# Altium schematic sheet [12]-Valve-Control.SchDoc: Valve-Control
size A3; Organization: Toradex AG; Address1: Altsagenstrasse 5; Address2: Horw; Address3: 6048; Address4: Switzerland; DocumentNumber: 11; Revision: V3.2; SheetNumber: 11; SheetTotal: 13; PageSetup: Record=PageOptions|CenterHorizontal=True|CenterVertical=True|PrintScale=0.73|XCorrection=1.00|YCorrection=1.00|PrintKind=0|BorderSize=5000000|LeftOffset=0|BottomOffset=0|Orientation=2|PaperLength=1000|PaperWidth=1000|Scale=100|PaperSource=7|PrintQuality=-4|MediaType=1|DitherType=10|PaperKind=A4|PrintScaleMode=1
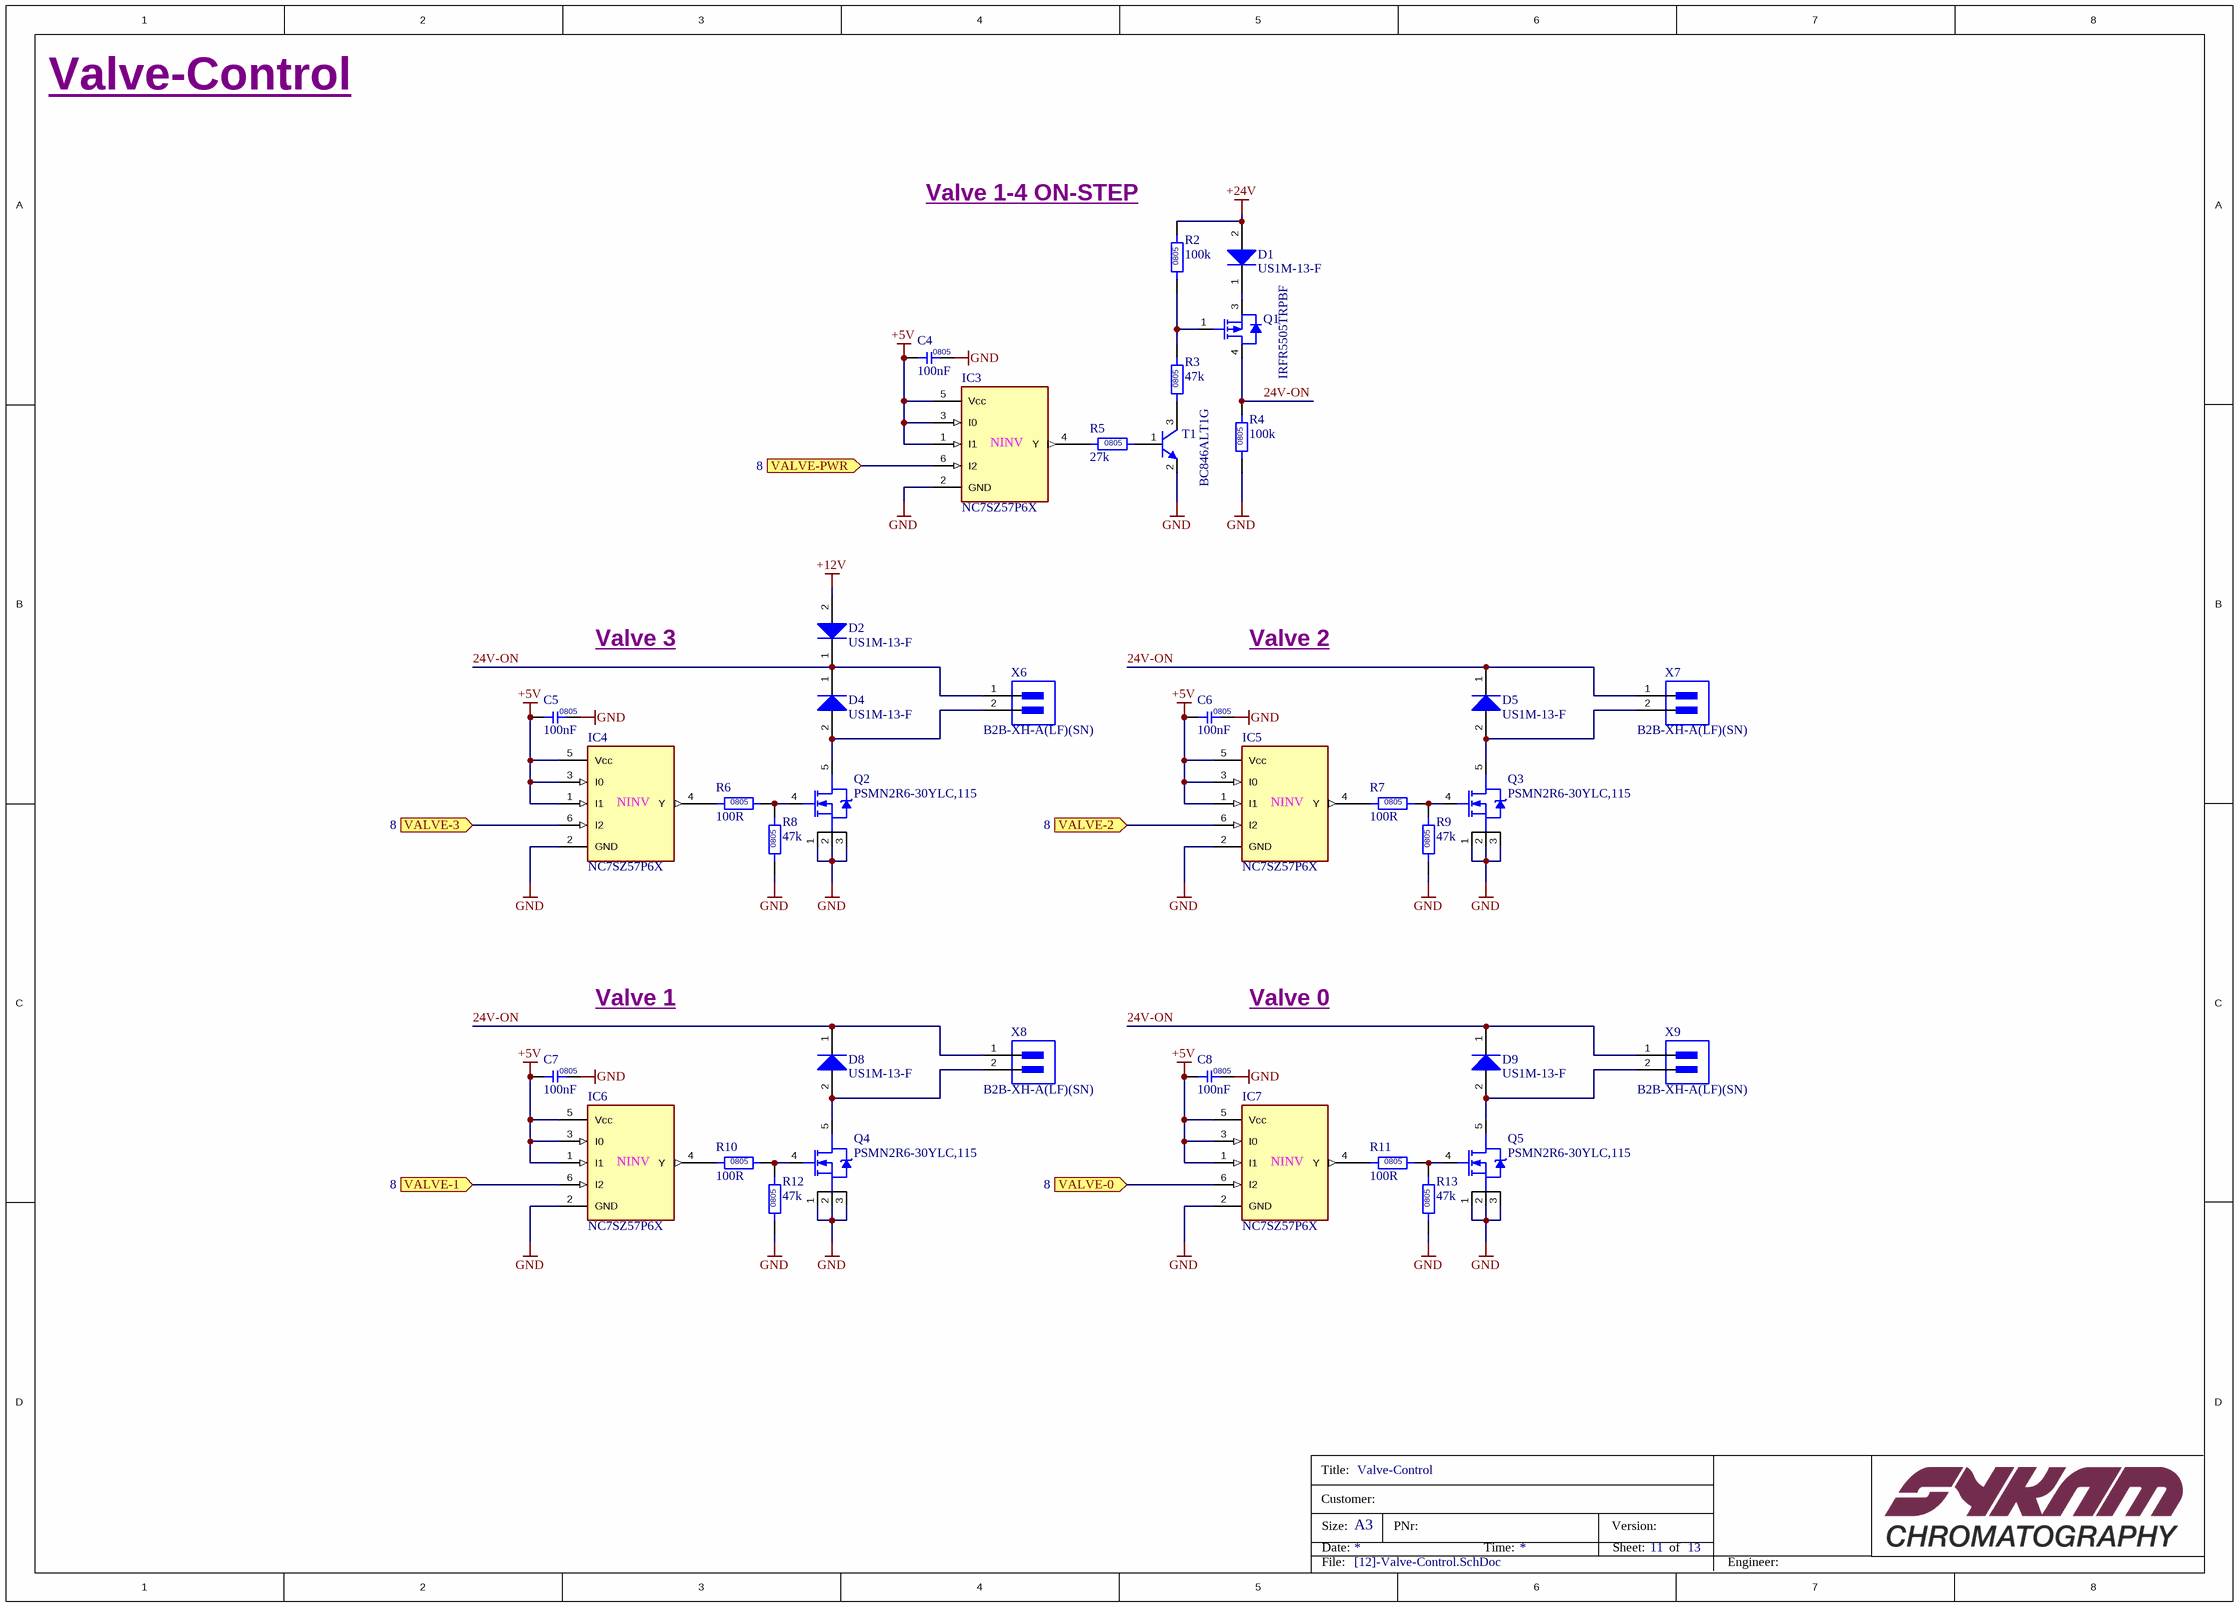
[diagram p0: [12]-Valve-Control.SchDoc]

## Parts
C4  100nF  [C0805]
C5  100nF  [C0805]
C6  100nF  [C0805]
C7  100nF  [C0805]
C8  100nF  [C0805]
D1  US1M-13-F  [US1M-SMA-2_A_V]
D2  US1M-13-F  [US1M-SMA-2_A_V]
D4  US1M-13-F  [US1M-SMA-2_A_V]
D5  US1M-13-F  [US1M-SMA-2_A_V]
D8  US1M-13-F  [US1M-SMA-2_A_V]
D9  US1M-13-F  [US1M-SMA-2_A_V]
IC3  NC7SZ57P6X  [NC7SZ57P6X]
IC4  NC7SZ57P6X  [NC7SZ57P6X]
IC5  NC7SZ57P6X  [NC7SZ57P6X]
IC6  NC7SZ57P6X  [NC7SZ57P6X]
IC7  NC7SZ57P6X  [NC7SZ57P6X]
Q1  IRFR5505TRPBF  [PMOS-DPak]
Q2  PSMN2R6-30YLC,115  [PSMN2R6-LFPAK_SOT669]
Q3  PSMN2R6-30YLC,115  [PSMN2R6-LFPAK_SOT669]
Q4  PSMN2R6-30YLC,115  [PSMN2R6-LFPAK_SOT669]
Q5  PSMN2R6-30YLC,115  [PSMN2R6-LFPAK_SOT669]
R2  100k  [R0805]
R3  47k  [R0805]
R4  100k  [R0805]
R5  27k  [R0805]
R6  100R  [R0805]
R7  100R  [R0805]
R8  47k  [R0805]
R9  47k  [R0805]
R10  100R  [R0805]
R11  100R  [R0805]
R12  47k  [R0805]
R13  47k  [R0805]
T1  BC846ALT1G  [ONSC-SOT-23-3-318-08_V]
X6  B2B-XH-A(LF)(SN)  [CON_2p_JST-B2B-XH-A_V]
X7  B2B-XH-A(LF)(SN)  [CON_2p_JST-B2B-XH-A_V]
X8  B2B-XH-A(LF)(SN)  [CON_2p_JST-B2B-XH-A_V]
X9  B2B-XH-A(LF)(SN)  [CON_2p_JST-B2B-XH-A_V]

## Ports
VALVE-0 (in, see 8), VALVE-1 (in, see 8), VALVE-2 (in, see 8), VALVE-3 (in, see 8), VALVE-PWR (in, see 8)

## Nets
+5V: C4.1 C5.1 C6.1 C7.1 C8.1 IC3.1(I1) IC3.3(I0) IC3.5(Vcc) IC4.1(I1) IC4.3(I0) IC4.5(Vcc) IC5.1(I1) IC5.3(I0) IC5.5(Vcc) IC6.1(I1) IC6.3(I0) IC6.5(Vcc) IC7.1(I1) IC7.3(I0) IC7.5(Vcc)
+12V: D2.2(K)
+24V: D1.2(K) R2.2
GND: C4.2 C5.2 C6.2 C7.2 C8.2 IC3.2(GND) IC4.2(GND) IC5.2(GND) IC6.2(GND) IC7.2(GND) Q2.1(D) Q2.2(D) Q2.3(D) Q3.1(D) Q3.2(D) Q3.3(D) Q4.1(D) Q4.2(D) Q4.3(D) Q5.1(D) Q5.2(D) Q5.3(D) R4.1 R8.1 R9.1 R12.1 R13.1 T1.2(E)
24V-ON: D2.1(A) D4.1(A) D5.1(A) D8.1(A) D9.1(A) Q1.4(D) R4.2 X6.1 X7.1 X8.1 X9.1
VALVE-0: IC7.6(I2) ; port VALVE-0
VALVE-1: IC6.6(I2) ; port VALVE-1
VALVE-2: IC5.6(I2) ; port VALVE-2
VALVE-3: IC4.6(I2) ; port VALVE-3
VALVE-PWR: IC3.6(I2) ; port VALVE-PWR
NetD1_1: D1.1(A) Q1.3(S)
NetD4_2: D4.2(K) Q2.5(D) X6.2
NetD5_2: D5.2(K) Q3.5(D) X7.2
NetD8_2: D8.2(K) Q4.5(D) X8.2
NetD9_2: D9.2(K) Q5.5(D) X9.2
NetIC3_4: IC3.4(Y) R5.1
NetIC4_4: IC4.4(Y) R6.1
NetIC5_4: IC5.4(Y) R7.1
NetIC6_4: IC6.4(Y) R10.1
NetIC7_4: IC7.4(Y) R11.1
NetQ1_1: Q1.1(G) R2.1 R3.2
NetQ2_4: Q2.4(G) R6.2 R8.2
NetQ3_4: Q3.4(G) R7.2 R9.2
NetQ4_4: Q4.4(G) R10.2 R12.2
NetQ5_4: Q5.4(G) R11.2 R13.2
NetR3_1: R3.1 T1.3(C)
NetR5_2: R5.2 T1.1(B)

## Notes on the sheet
- Valve 1-4 ON-STEP
- (near IC3) NINV
- Valve 3
- Valve 2
- (near IC4) NINV
- (near IC5) NINV
- Valve 1
- Valve 0
- (near IC6) NINV
- (near IC7) NINV
- Title:
- Customer:
- Size:
- Date:
- A3
- PNr:
- Time:
- Version:
- Sheet:
- of
- File:
- Engineer:
- Title
- Number:
- Revision:
- Sheet

## Library data of the parts
C4-C8 = C_100nF_CC0805KRX7R9BB104: CAP CER 0.1UF 50V X7R 0805; Manufacturer: Yageo; Material: Ceramic; Tolerance: 10%; Insulation Resistance: 100GR; PCBChecked: initials after Checked; Supplier 1: Digi-Key; Manufacturer Part Number: CC0805KRX7R9BB104; RoHS: Yes; Category: Ceramic Capacitors; Mount: Surface Mount; Case/Package: 0805; Number of Pins: 2; Case Code (Metric): 2012; Case Code (Imperial): 0805; Min Operating Temperature: -55°C; Max Operating Temperature: 125°C; Packaging: Tape and Reel; Capacitance: 100nF; Voltage Rating: 50V; Package Quantity: 1; Dielectric: X7R; Termination: SMD/SMT; Voltage: 50V; Length: 2mm; Height: 0.85mm; Width: 0.049inch; Thickness: 0.033inch; Depth: 1.25mm; Radiation Hardening: No; REACH SVHC: No SVHC; Lead Free: Lead Free; Halogen Free: Halogen Free; ComponentLink1URL: https://datasheet.ciiva.com/11786/0900766b80d84f1d-11786009.pdf?src-supplier=RSComponents; ComponentLink1Description: https://datasheet.ciiva.com/11786/0900766b80d84f1d-11786009.pdf?src-supplier=RSComponents; ComponentLink2URL: https://datasheet.ciiva.com/11464/upy-gphc-x7r-6-3v-to-50v-8-11464757.pdf?src-supplier=Avnet; ComponentLink2Description: https://datasheet.ciiva.com/11464/upy-gphc-x7r-6-3v-to-50v-8-11464757.pdf?src-supplier=Avnet; ComponentLink3URL: https://datasheet.ciiva.com/28450/1489800-28450805.pdf?src-supplier=Element14; ComponentLink3Description: https://datasheet.ciiva.com/28450/1489800-28450805.pdf?src-supplier=Element14; ComponentLink4URL: https://datasheet.ciiva.com/155/mlccorderingcode-155929.pdf?src-supplier=Digi-Key; ComponentLink4Description: https://datasheet.ciiva.com/155/mlccorderingcode-155929.pdf?src-supplier=Digi-Key; ComponentLink5URL: https://datasheet.ciiva.com/155/mlccorderingcode-155930.pdf?src-supplier=Digi-Key; ComponentLink5Description: https://datasheet.ciiva.com/155/mlccorderingcode-155930.pdf?src-supplier=Digi-Key; ComponentLink6URL: https://datasheet.ciiva.com/155/mlccorderingcode-155931.pdf?src-supplier=Digi-Key; ComponentLink6Description: https://datasheet.ciiva.com/155/mlccorderingcode-155931.pdf?src-supplier=Digi-Key; ComponentLink7URL: https://datasheet.ciiva.com/46393/1734573-46393307.pdf?src-supplier=Element14; ComponentLink7Description: https://datasheet.ciiva.com/46393/1734573-46393307.pdf?src-supplier=Element14; ComponentLink8URL: https://datasheet.ciiva.com/16625/upy-gphc-x7r-6-3v-to-50v-8-16625549.pdf?src-supplier=Avnet+Europe; ComponentLink8Description: https://datasheet.ciiva.com/16625/upy-gphc-x7r-6-3v-to-50v-8-16625549.pdf?src-supplier=Avnet+Europe; ComponentLink9URL: https://datasheet.ciiva.com/29242/445210-da-01-en-kerko-chip-0805-x7r-0-1uf-10proz-50vg-29242074.pdf?src-supplier=Conrad; ComponentLink9Description: https://datasheet.ciiva.com/29242/445210-da-01-en-kerko-chip-0805-x7r-0-1uf-10proz-50vg-29242074.pdf?src-supplier=Conrad; Supplier Part Number 1: 311-1140-6-ND; Stock 1: 7118979; IPC7352C: done; SCHChecked: Initials after checked
D1 D2 D4 D5 D8 D9 = D_US1M-13-F: Diode Switching 1KV 1A 2-Pin SMA T/R; Manufacturer: Diodes; Element Configuration: Single; Forward Voltage: 1.7V; Reverse Recovery Time: 75ns; Peak Non-Repetitive Surge Current: 30A; Max Reverse Current: 5uA; Polarity: Standard; Capacitance: 10pF; Supplier 1: Farnell; Manufacturer Part Number: US1M-13-F; RoHS: Yes; Category: Rectifier Diodes; Stock 1: 15876; Pricing 1: 5=0,29300, 25=0,21800, 100=0,14200, 250=0,12400, 500=0,10500, 1000=0,08140, 5000=0,07050 (EUR); Mount: Surface Mount; Case/Package: SMA; Number of Pins: 2; Weight: 0.002258oz; Contact Plating: Tin,Matte; Min Operating Temperature: -65°C; Max Operating Temperature: 150°C; Packaging: Tape and Reel; Average Rectified Current: 1A; Max Reverse Voltage (DC): 1kV; Max Repetitive Reverse Voltage (Vrrm): 1kV; Package Quantity: 5000; Forward Current: 1A; Recovery Time: 75ns; Max Surge Current: 30A; Max Forward Surge Current (Ifsm): 30A; Voltage Rating (DC): 1kV; Current Rating: 1A; Output Current: 1A; Termination: SMD/SMT; Reverse Voltage (DC): 1kV; Length: 4.6mm; Width: 2.92mm; Height: 2.1mm; Radiation Hardening: No; Lead Free: Lead Free; REACH SVHC: No SVHC; ComponentLink1URL: https://datasheet.ciiva.com/27052/1542696-27052440.pdf?src-supplier=Jameco; ComponentLink1Description: https://datasheet.ciiva.com/27052/1542696-27052440.pdf?src-supplier=Jameco; ComponentLink2URL: https://datasheet.ciiva.com/4454/ds16008-60440-4454096.pdf?src-supplier=Mouser; ComponentLink2Description: https://datasheet.ciiva.com/4454/ds16008-60440-4454096.pdf?src-supplier=Mouser; ComponentLink3URL: https://datasheet.ciiva.com/917/ds16008-917195.pdf?src-supplier=Digi-Key; ComponentLink3Description: https://datasheet.ciiva.com/917/ds16008-917195.pdf?src-supplier=Digi-Key; ComponentLink4URL: https://datasheet.ciiva.com/917/ds16008-917196.pdf?src-supplier=Digi-Key; ComponentLink4Description: https://datasheet.ciiva.com/917/ds16008-917196.pdf?src-supplier=Digi-Key; ComponentLink5URL: https://datasheet.ciiva.com/22695/1906610-22695853.pdf?src-supplier=Element14; ComponentLink5Description: https://datasheet.ciiva.com/22695/1906610-22695853.pdf?src-supplier=Element14; ComponentLink6URL: https://datasheet.ciiva.com/8301/ds16008-8301519.pdf?src-supplier=Avnet; ComponentLink6Description: https://datasheet.ciiva.com/8301/ds16008-8301519.pdf?src-supplier=Avnet; ComponentLink7URL: https://datasheet.ciiva.com/8303/ds16008-8303103.pdf?src-supplier=Avnet; ComponentLink7Description: https://datasheet.ciiva.com/8303/ds16008-8303103.pdf?src-supplier=Avnet; Supplier Part Number 1: 1858603
IC3-IC7 = IC_NC7SZ57P6X: FAIRCHILD SEMICONDUCTOR         NC7SZ57P6X.            Multi-Function Logic Gate, Configurable, Ultra High Speed, 3 Input, 32 mA, 1.65V to 5.5V, SC-70-6; Manufacturer: ON Semiconductor / Fairchild; High Level Output Current: -32mA; Low Level Output Current: 32mA; Number of Gates: 1; Propagation Delay: 14.5ns; Logic Function: Multi Function; Quiescent Current: 1uA; Number of Inputs: 2; Schmitt Trigger Input: Yes; PCBChecked: initials after Checked; Supplier 1: Digi-Key; Manufacturer Part Number: NC7SZ57P6X; RoHS: Yes; Category: Logic Gates; Mount: Surface Mount; Case/Package: SC; Number of Pins: 6; Weight: 0.028g; Number of Terminals: 6; Min Operating Temperature: -40°C; Max Operating Temperature: 85°C; Max Supply Voltage: 5.5V; Min Supply Voltage: 1.65V; Packaging: Tape and Reel; Number of Circuits: 1; Turn-On Delay Time: 14.5ns; Number of Outputs: 1; Number of Elements: 1; Output Current: 32mA; Package Quantity: 3000; Length: 2mm; Height: 1mm; Width: 1.25mm; Radiation Hardening: No; Lead Free: Lead Free; REACH SVHC: No SVHC; ComponentLink1URL: https://datasheet.ciiva.com/34301/874445-34301638.pdf?src-supplier=Jameco; ComponentLink1Description: https://datasheet.ciiva.com/34301/874445-34301638.pdf?src-supplier=Jameco; ComponentLink2URL: https://datasheet.ciiva.com/25628/0900766b80f9b61c-25628492.pdf?src-supplier=RSComponents; ComponentLink2Description: https://datasheet.ciiva.com/25628/0900766b80f9b61c-25628492.pdf?src-supplier=RSComponents; ComponentLink3URL: https://datasheet.ciiva.com/15090/getdatasheetpartid-53023-15090335.pdf?src-supplier=Verical; ComponentLink3Description: https://datasheet.ciiva.com/15090/getdatasheetpartid-53023-15090335.pdf?src-supplier=Verical; ComponentLink4URL: https://datasheet.ciiva.com/1880/nc7sz57-1880020.pdf?src-supplier=Digi-Key; ComponentLink4Description: https://datasheet.ciiva.com/1880/nc7sz57-1880020.pdf?src-supplier=Digi-Key; ComponentLink5URL: https://datasheet.ciiva.com/8249/nc7sz57-8249558.pdf?src-supplier=Avnet; ComponentLink5Description: https://datasheet.ciiva.com/8249/nc7sz57-8249558.pdf?src-supplier=Avnet; ComponentLink6URL: https://datasheet.ciiva.com/16503/nc7sz57-16503560.pdf?src-supplier=Avnet+Asia; ComponentLink6Description: https://datasheet.ciiva.com/16503/nc7sz57-16503560.pdf?src-supplier=Avnet+Asia; ComponentLink7URL: https://datasheet.ciiva.com/1880/nc7sz57-1880021.pdf?src-supplier=Digi-Key; ComponentLink7Description: https://datasheet.ciiva.com/1880/nc7sz57-1880021.pdf?src-supplier=Digi-Key; ComponentLink8URL: https://datasheet.ciiva.com/7970/1727673-7970677.pdf?src-supplier=Element14; ComponentLink8Description: https://datasheet.ciiva.com/7970/1727673-7970677.pdf?src-supplier=Element14; ComponentLink9URL: https://datasheet.ciiva.com/1880/nc7sz57-1880022.pdf?src-supplier=Digi-Key; ComponentLink9Description: https://datasheet.ciiva.com/1880/nc7sz57-1880022.pdf?src-supplier=Digi-Key; ComponentLink10URL: https://datasheet.ciiva.com/16977/nc7sz57-16977945.pdf?src-supplier=Future+Electronics; ComponentLink10Description: https://datasheet.ciiva.com/16977/nc7sz57-16977945.pdf?src-supplier=Future+Electronics; Supplier Part Number 1: NC7SZ57P6XCT-ND; Stock 1: 16277; IPC7352C: done; SCHChecked: Initials after checked
Q1 = Q_PMOS_IRFR5505TRPBF: MOSFET, P CH, -55V, -18A, TO-252AA-3; Transistor Polarity:P Channel; Continuous Drain Current Id:-18A; Drain Source Voltage Vds:-55V; On Resistance Rds(on):0.11ohm; Rds(on) Test Voltage Vgs:-10V; Threshold Voltage Vgs:-4V; Power Dissipation Pd:57W; Transistor Case Style:TO-252AA; No. of Pins:3; Operating Temperature Max:150°C; MSL:MSL 1 - Unlimited; SVHC:No SVHC (15-Jun-2015); Manufacturer: International Rectifier; Continuous Drain Current (ID): 18A; Fall Time: 16ns; Gate to Source Voltage (Vgs): 20V; Turn-Off Delay Time: 20ns; Turn-On Delay Time: 12ns; Rise Time: 28ns; Drain to Source Voltage (Vdss): 55V; Power Dissipation: 57W; Rds On Max: 110mR; Input Capacitance: 650pF; Number of Elements: 1; Element Configuration: Single; Nominal Vgs: -4V; Supplier 1: Farnell; Manufacturer Part Number: IRFR5505TRPBF; RoHS: Yes; Category: MOSFETs; Stock 1: 10190; Pricing 1: 1=0,89800, 10=0,68100, 100=0,49300, 250=0,45800, 500=0,42300, 1000=0,32500, 5000=0,29600 (EUR); Mount: Surface Mount; Case/Package: DPAK; Number of Pins: 3; Min Operating Temperature: -55°C; Max Operating Temperature: 150°C; Packaging: Tape and Reel; Package Quantity: 1; Max Power Dissipation: 57W; Drain to Source Resistance: 110mR; Voltage Rating (DC): -55V; Current Rating: -18A; Drain to Source Breakdown Voltage: -55V; On-State Resistance: 110mR; Threshold Voltage: -4V; Length: 6.73mm; Width: 6.22mm; Height: 2.39mm; Radiation Hardening: No; Lead Free: Lead Free; REACH SVHC: No SVHC; ComponentLink1URL: https://datasheet.ciiva.com/6382/irfr5505pbf-6382422.pdf?src-supplier=Digi-Key; ComponentLink1Description: https://datasheet.ciiva.com/6382/irfr5505pbf-6382422.pdf?src-supplier=Digi-Key; ComponentLink2URL: https://datasheet.ciiva.com/7798/irfr5505-7798823.pdf?src-supplier=Element14; ComponentLink2Description: https://datasheet.ciiva.com/7798/irfr5505-7798823.pdf?src-supplier=Element14; ComponentLink3URL: https://datasheet.ciiva.com/6382/irfr5505pbf-6382424.pdf?src-supplier=Digi-Key; ComponentLink3Description: https://datasheet.ciiva.com/6382/irfr5505pbf-6382424.pdf?src-supplier=Digi-Key; ComponentLink4URL: https://datasheet.ciiva.com/16222/irfr5505pbf-16222552.pdf?src-supplier=Future+Electronics; ComponentLink4Description: https://datasheet.ciiva.com/16222/irfr5505pbf-16222552.pdf?src-supplier=Future+Electronics; ComponentLink5URL: https://datasheet.ciiva.com/6382/irfr5505pbf-6382428.pdf?src-supplier=Digi-Key; ComponentLink5Description: https://datasheet.ciiva.com/6382/irfr5505pbf-6382428.pdf?src-supplier=Digi-Key; Supplier Part Number 1: 2468041
Q2-Q5 = Q_NMOS_PSMN2R6-30YLC,115: PSMN2R6-30YLC - N-channel 30 V 2.8 mΩ logic level MOSFET in LFPAK using NextPower technology; Manufacturer: Nexperia; Supplier 1: Farnell; Manufacturer Part Number: PSMN2R6-30YLC,115; Stock 1: 1500; Pricing 1: 1=0,65800, 10=0,52700, 100=0,41600, 250=0,38700, 500=0,35600, 1000=0,29800, 5000=0,28500 (EUR); ComponentLink1URL: http://datasheet.octopart.com/PSMN2R6-30YLC%2C115-Nexperia-datasheet-87582230.pdf?src-supplier=Nexperia; ComponentLink1Description: http://datasheet.octopart.com/PSMN2R6-30YLC%2C115-Nexperia-datasheet-87582230.pdf?src-supplier=Nexperia; ComponentLink2URL: http://datasheet.octopart.com/PSMN2R6-30YLC%2C115-Nexperia-datasheet-10409835.pdf?src-supplier=Upverter; ComponentLink2Description: http://datasheet.octopart.com/PSMN2R6-30YLC%2C115-Nexperia-datasheet-10409835.pdf?src-supplier=Upverter; ComponentLink3URL: http://datasheet.octopart.com/PSMN2R6-30YLC%2C115-Nexperia-datasheet-78818593.pdf?src-supplier=Future+Electronics; ComponentLink3Description: http://datasheet.octopart.com/PSMN2R6-30YLC%2C115-Nexperia-datasheet-78818593.pdf?src-supplier=Future+Electronics; ComponentLink4URL: http://datasheet.octopart.com/PSMN2R6-30YLC%2C115-NXP-Semiconductors-datasheet-11789213.pdf?src-supplier=Arrow+Electronics; ComponentLink4Description: http://datasheet.octopart.com/PSMN2R6-30YLC%2C115-NXP-Semiconductors-datasheet-11789213.pdf?src-supplier=Arrow+Electronics; Supplier Part Number 1: 3440108
R2 R4 = R_100k_RC0805FR-07100KL: RES SMD 100K OHM 1% 1/8W 0805; Manufacturer: Yageo; Resistance: 100kR; Temperature Coefficient: 100ppm/°C; Power Rating: 125mW; Voltage Rating (DC): 150V; PCBChecked: initials after Checked; Supplier 1: Digi-Key; Manufacturer Part Number: RC0805FR-07100KL; RoHS: Yes; Category: Chip SMD Resistors; Case/Package: 0805; Number of Pins: 2; Case Code (Metric): 2012; Case Code (Imperial): 0805; Min Operating Temperature: -55°C; Max Operating Temperature: 155°C; Tolerance: 1%; Packaging: Tape and Reel; Composition: Thick Film; Voltage Rating: 150V; Package Quantity: 1; Number of Terminations: 2; Termination: SMD/SMT; Military Standard: Not; Max Power Dissipation: 125mW; Features: Moisture Resistant; Length: 2mm; Height: 0.024inch; Width: 0.049inch; Depth: 1.25mm; Lead Pitch: 0.4mm; REACH SVHC: Unknown; Lead Free: Lead Free; ComponentLink1URL: https://datasheet.ciiva.com/11808/0900766b8106beab-11808858.pdf?src-supplier=RSComponents; ComponentLink1Description: https://datasheet.ciiva.com/11808/0900766b8106beab-11808858.pdf?src-supplier=RSComponents; ComponentLink2URL: https://datasheet.ciiva.com/2457/pyu-r-int-thick-7-2457017.pdf?src-supplier=Digi-Key; ComponentLink2Description: https://datasheet.ciiva.com/2457/pyu-r-int-thick-7-2457017.pdf?src-supplier=Digi-Key; ComponentLink3URL: https://datasheet.ciiva.com/12667/rc0805-12667001.pdf?src-supplier=Mouser; ComponentLink3Description: https://datasheet.ciiva.com/12667/rc0805-12667001.pdf?src-supplier=Mouser; ComponentLink4URL: https://datasheet.ciiva.com/2457/pyu-r-int-thick-7-2457018.pdf?src-supplier=Digi-Key; ComponentLink4Description: https://datasheet.ciiva.com/2457/pyu-r-int-thick-7-2457018.pdf?src-supplier=Digi-Key; ComponentLink5URL: https://datasheet.ciiva.com/16747/rc0805-16747226.pdf?src-supplier=Future+Electronics; ComponentLink5Description: https://datasheet.ciiva.com/16747/rc0805-16747226.pdf?src-supplier=Future+Electronics; ComponentLink6URL: https://datasheet.ciiva.com/2457/pyu-r-int-thick-7-2457019.pdf?src-supplier=Digi-Key; ComponentLink6Description: https://datasheet.ciiva.com/2457/pyu-r-int-thick-7-2457019.pdf?src-supplier=Digi-Key; ComponentLink7URL: https://datasheet.ciiva.com/7660/38627-7660796.pdf?src-supplier=Element14; ComponentLink7Description: https://datasheet.ciiva.com/7660/38627-7660796.pdf?src-supplier=Element14; ComponentLink8URL: https://datasheet.ciiva.com/7941/1697719-7941676.pdf?src-supplier=Element14; ComponentLink8Description: https://datasheet.ciiva.com/7941/1697719-7941676.pdf?src-supplier=Element14; ComponentLink9URL: https://datasheet.ciiva.com/7941/1686128-7941677.pdf?src-supplier=Element14; ComponentLink9Description: https://datasheet.ciiva.com/7941/1686128-7941677.pdf?src-supplier=Element14; ComponentLink10URL: https://datasheet.ciiva.com/7941/1697719-7941678.pdf?src-supplier=Element14; ComponentLink10Description: https://datasheet.ciiva.com/7941/1697719-7941678.pdf?src-supplier=Element14; ComponentLink11URL: https://datasheet.ciiva.com/22747/444164-22747534.pdf?src-supplier=Element14; ComponentLink11Description: https://datasheet.ciiva.com/22747/444164-22747534.pdf?src-supplier=Element14; Supplier Part Number 1: 311-100KCRCT-ND; Stock 1: 6543127; IPC7352C: done; SCHChecked: Initials after checked
R3 R8 R9 R12 R13 = R_47k_CRCW080547K0FKEA: SMD Resistor, Thick film 47 kOhm,  ±  1 %, 0805, CRCW080547K0FKEA, Vishay; Resistance: 47kR; Tolerance: 1%; Temperature Coefficient: 100ppm/°C; Power Rating: 125mW; Voltage Rating: 150V; Supplier 1: Farnell; Manufacturer: Vishay; Manufacturer Part Number: CRCW080547K0FKEA; RoHS: Yes; Category: Chip SMD Resistors; Stock 1: 27525; Pricing 1: 10=0,07230, 100=0,02890, 500=0,02010, 1000=0,01130, 2500=0,00890, 5000=0,00530, 25000=0,00490 (EUR); Case/Package: 0805; Case Code (Imperial): 0805; Case Code (Metric): 2012; Contact Plating: Tin; Weight: 0.000194oz; Min Operating Temperature: -55°C; Max Operating Temperature: 155°C; Packaging: Tape and Reel; Resistor Type: Thick Film; Termination: SMD/SMT; Voltage Rating (DC): 150V; Package Quantity: 10; Number of Terminations: 2; Max Power Dissipation: 125mW; Features: Automotive AEC-Q200; Working Voltage: 150V; Length: 2mm; Width: 1.25mm; Height: 0.45mm; Depth: 1.25mm; Radiation Hardening: No; Lead Free: Lead Free; REACH SVHC: Unknown; Military Standard: Not; ComponentLink1URL: https://datasheet.ciiva.com/11809/0900766b80d98b26-11809181.pdf?src-supplier=RSComponents; ComponentLink1Description: https://datasheet.ciiva.com/11809/0900766b80d98b26-11809181.pdf?src-supplier=RSComponents; ComponentLink2URL: https://datasheet.ciiva.com/2514/dcrcwe3-2514312.pdf?src-supplier=Digi-Key; ComponentLink2Description: https://datasheet.ciiva.com/2514/dcrcwe3-2514312.pdf?src-supplier=Digi-Key; ComponentLink3URL: https://datasheet.ciiva.com/16204/dcrcwe3-16204264.pdf?src-supplier=Future+Electronics; ComponentLink3Description: https://datasheet.ciiva.com/16204/dcrcwe3-16204264.pdf?src-supplier=Future+Electronics; ComponentLink4URL: https://datasheet.ciiva.com/26314/fld-crcw-e3-data-en-26314584.pdf?src-supplier=Distrelec; ComponentLink4Description: https://datasheet.ciiva.com/26314/fld-crcw-e3-data-en-26314584.pdf?src-supplier=Distrelec; ComponentLink5URL: https://datasheet.ciiva.com/16723/70201119-16723909.pdf?src-supplier=Allied+Electronics; ComponentLink5Description: https://datasheet.ciiva.com/16723/70201119-16723909.pdf?src-supplier=Allied+Electronics; ComponentLink6URL: https://datasheet.ciiva.com/2514/dcrcwe3-2514311.pdf?src-supplier=Digi-Key; ComponentLink6Description: https://datasheet.ciiva.com/2514/dcrcwe3-2514311.pdf?src-supplier=Digi-Key; ComponentLink7URL: https://datasheet.ciiva.com/7777/1720486-7777577.pdf?src-supplier=Element14; ComponentLink7Description: https://datasheet.ciiva.com/7777/1720486-7777577.pdf?src-supplier=Element14; ComponentLink8URL: https://datasheet.ciiva.com/9006/dcrcwe3-9006477.pdf?src-supplier=Avnet; ComponentLink8Description: https://datasheet.ciiva.com/9006/dcrcwe3-9006477.pdf?src-supplier=Avnet; ComponentLink9URL: https://datasheet.ciiva.com/17178/dcrcwe3-17178445.pdf?src-supplier=Avnet+Europe; ComponentLink9Description: https://datasheet.ciiva.com/17178/dcrcwe3-17178445.pdf?src-supplier=Avnet+Europe; ComponentLink10URL: https://datasheet.ciiva.com/7777/1697337-7777406.pdf?src-supplier=Element14; ComponentLink10Description: https://datasheet.ciiva.com/7777/1697337-7777406.pdf?src-supplier=Element14; Supplier Part Number 1: 1469929
R5 = R_27k_RC0805FR-0727KL: Surface Mount Thick Film Resistor, RC Series, 27 kohm, 125 mW, - 1%, 150 V, 0805 [2012 Metric]; Manufacturer: Yageo; Resistance: 27kR; Temperature Coefficient: 100ppm/°C; Power Rating: 125mW; Voltage Rating: 150V; Supplier 1: Digi-Key; Manufacturer Part Number: RC0805FR-0727KL; RoHS: Yes; Category: Chip SMD Resistors; Stock 1: 307907; Pricing 1: 1=0,10000, 10=0,04000, 100=0,01630, 1000=0,00731, 2500=0,00635 (USD); Case/Package: 0805; Case Code (Metric): 2012; Case Code (Imperial): 0805; Min Operating Temperature: -55°C; Max Operating Temperature: 155°C; Tolerance: 1%; Composition: Thick Film; Packaging: Tape and Reel; Package Quantity: 1; Number of Terminations: 2; Termination: SMD/SMT; Military Standard: Not; Max Power Dissipation: 125mW; Features: Moisture Resistant; Length: 2mm; Height: 0.5mm; Width: 0.049inch; Depth: 1.25mm; Lead Free: Lead Free; REACH SVHC: Unknown; ComponentLink1URL: https://datasheet.ciiva.com/11809/0900766b8106beab-11809381.pdf?src-supplier=RSComponents; ComponentLink1Description: https://datasheet.ciiva.com/11809/0900766b8106beab-11809381.pdf?src-supplier=RSComponents; ComponentLink2URL: https://datasheet.ciiva.com/2457/pyu-r-int-thick-7-2457986.pdf?src-supplier=Digi-Key; ComponentLink2Description: https://datasheet.ciiva.com/2457/pyu-r-int-thick-7-2457986.pdf?src-supplier=Digi-Key; ComponentLink3URL: https://datasheet.ciiva.com/2457/pyu-r-int-thick-7-2457988.pdf?src-supplier=Digi-Key; ComponentLink3Description: https://datasheet.ciiva.com/2457/pyu-r-int-thick-7-2457988.pdf?src-supplier=Digi-Key; ComponentLink4URL: https://datasheet.ciiva.com/7941/444164-7941751.pdf?src-supplier=Element14; ComponentLink4Description: https://datasheet.ciiva.com/7941/444164-7941751.pdf?src-supplier=Element14; ComponentLink5URL: https://datasheet.ciiva.com/2457/pyu-r-int-thick-7-2457987.pdf?src-supplier=Digi-Key; ComponentLink5Description: https://datasheet.ciiva.com/2457/pyu-r-int-thick-7-2457987.pdf?src-supplier=Digi-Key; ComponentLink6URL: https://datasheet.ciiva.com/7941/444164-7941750.pdf?src-supplier=Element14; ComponentLink6Description: https://datasheet.ciiva.com/7941/444164-7941750.pdf?src-supplier=Element14; Supplier Part Number 1: 311-27.0KCRCT-ND
R6 R7 R10 R11 = R_100R_RC0805FR-07100RL: Res Thick Film 0805 100 Ohm 1% 0.125W(1/8W) ±100ppm/C Epoxy SMD T/R; Manufacturer: Yageo; Temperature Coefficient: 100ppm/°C; Max Power Dissipation: 125mW; Voltage Rating: 150V; Application(s): HIGH RELIABILITY; Supplier 1: Farnell; Manufacturer Part Number: RC0805FR-07100RL; RoHS: Yes; Category: Chip SMD Resistors; Stock 1: 355000; Pricing 1: 5000=0,00660, 25000=0,00480 (EUR); Case/Package: 0805; Number of Pins: 2; Case Code (Imperial): 0805; Case Code (Metric): 2012; Weight: 0.000917oz; Min Operating Temperature: -55°C; Max Operating Temperature: 155°C; Resistance: 100R; Packaging: Cut Tape; Tolerance: 1%; Resistor Type: Thick Film; Number of Terminations: 2; Series: RC; Power Rating: 125mW; Termination: SMD/SMT; Voltage Rating (DC): 150V; Package Quantity: 5000; Features: Moisture Resistant; Technology: THICK FILM; Type: General Purpose; Length: 2mm; Width: 1.25mm; Height: 0.5mm; Depth: 1.25mm; Lead Pitch: 0.4mm; RoHS Compliant: Yes; Lead Free: Lead Free; REACH SVHC: Unknown; Military Standard: Not; ComponentLink1URL: https://datasheet.ciiva.com/7941/1697719-7941680.pdf?src-supplier=Element14; ComponentLink1Description: https://datasheet.ciiva.com/7941/1697719-7941680.pdf?src-supplier=Element14; ComponentLink2URL: https://datasheet.ciiva.com/11808/0900766b8106beab-11808877.pdf?src-supplier=RSComponents; ComponentLink2Description: https://datasheet.ciiva.com/11808/0900766b8106beab-11808877.pdf?src-supplier=RSComponents; ComponentLink3URL: https://datasheet.ciiva.com/17082/rc0805-17082697.pdf?src-supplier=Future+Electronics; ComponentLink3Description: https://datasheet.ciiva.com/17082/rc0805-17082697.pdf?src-supplier=Future+Electronics; ComponentLink4URL: https://datasheet.ciiva.com/46447/444164-46447562.pdf?src-supplier=Element14; ComponentLink4Description: https://datasheet.ciiva.com/46447/444164-46447562.pdf?src-supplier=Element14; ComponentLink5URL: https://datasheet.ciiva.com/2456/pyu-r-int-thick-7-2456987.pdf?src-supplier=Digi-Key; ComponentLink5Description: https://datasheet.ciiva.com/2456/pyu-r-int-thick-7-2456987.pdf?src-supplier=Digi-Key; ComponentLink6URL: https://datasheet.ciiva.com/2456/pyu-r-int-thick-7-2456988.pdf?src-supplier=Digi-Key; ComponentLink6Description: https://datasheet.ciiva.com/2456/pyu-r-int-thick-7-2456988.pdf?src-supplier=Digi-Key; ComponentLink7URL: https://datasheet.ciiva.com/2456/pyu-r-int-thick-7-2456989.pdf?src-supplier=Digi-Key; ComponentLink7Description: https://datasheet.ciiva.com/2456/pyu-r-int-thick-7-2456989.pdf?src-supplier=Digi-Key; ComponentLink8URL: https://datasheet.ciiva.com/7660/38627-7660797.pdf?src-supplier=Element14; ComponentLink8Description: https://datasheet.ciiva.com/7660/38627-7660797.pdf?src-supplier=Element14; ComponentLink9URL: https://datasheet.ciiva.com/7941/1686128-7941679.pdf?src-supplier=Element14; ComponentLink9Description: https://datasheet.ciiva.com/7941/1686128-7941679.pdf?src-supplier=Element14; ComponentLink10URL: https://datasheet.ciiva.com/22747/444164-22747535.pdf?src-supplier=Element14; ComponentLink10Description: https://datasheet.ciiva.com/22747/444164-22747535.pdf?src-supplier=Element14; Supplier Part Number 1: 2421934
T1 = T_BC846ALT1G: ON SEMICONDUCTOR - BC846ALT1G - BIPOLAR TRANSISTOR, FULL REEL; Collector Emitter Voltage (VCEO): 65V; Polarity: NPN; Max Power Dissipation: 300mW; Max Collector Current: 100mA; Emitter Base Voltage (VEBO): 6V; Collector Base Voltage (VCBO): 80V; Transition Frequency: 100MHz; Element Configuration: Single; Number of Elements: 1; Collector Emitter Saturation Voltage: 600mV; hFE Min: 110; Supplier 1: Digi-Key; Manufacturer: ON Semiconductor; Manufacturer Part Number: BC846ALT1G; RoHS: Yes; Category: BJTs; Stock 1: 258757; Pricing 1: 1=0,12000, 10=0,10900, 25=0,10360, 100=0,04570, 250=0,04384, 500=0,03586, 1000=0,02490 (USD); Case/Package: SOT-23-3; Number of Pins: 3; Contact Plating: Tin,Matte; Min Operating Temperature: -55°C; Max Operating Temperature: 150°C; Packaging: Tape and Reel; Collector Emitter Breakdown Voltage: 65V; Package Quantity: 1; Gain Bandwidth Product: 100MHz; Power Dissipation: 300mW; Frequency: 100MHz; Max Breakdown Voltage: 65V; Max Frequency: 100MHz; Voltage Rating (DC): 65V; Current Rating: 100mA; Length: 2.9mm; Height: 0.94mm; Width: 1.3mm; Radiation Hardening: No; Lead Free: Lead Free; REACH SVHC: No SVHC; Halogen Free: Halogen Free; ComponentLink1URL: https://datasheet.ciiva.com/15138/getdatasheetpartid-38432-15138609.pdf?src-supplier=Verical; ComponentLink1Description: https://datasheet.ciiva.com/15138/getdatasheetpartid-38432-15138609.pdf?src-supplier=Verical; ComponentLink2URL: https://datasheet.ciiva.com/976/bc846alt1-d-976374.pdf?src-supplier=Digi-Key; ComponentLink2Description: https://datasheet.ciiva.com/976/bc846alt1-d-976374.pdf?src-supplier=Digi-Key; ComponentLink3URL: https://datasheet.ciiva.com/976/bc846alt1-d-976375.pdf?src-supplier=Digi-Key; ComponentLink3Description: https://datasheet.ciiva.com/976/bc846alt1-d-976375.pdf?src-supplier=Digi-Key; ComponentLink4URL: https://datasheet.ciiva.com/976/bc846alt1-d-976376.pdf?src-supplier=Digi-Key; ComponentLink4Description: https://datasheet.ciiva.com/976/bc846alt1-d-976376.pdf?src-supplier=Digi-Key; ComponentLink5URL: https://datasheet.ciiva.com/22664/1571861-22664104.pdf?src-supplier=Element14; ComponentLink5Description: https://datasheet.ciiva.com/22664/1571861-22664104.pdf?src-supplier=Element14; ComponentLink6URL: https://datasheet.ciiva.com/7972/bc846alt1-d-7972186.pdf?src-supplier=Element14; ComponentLink6Description: https://datasheet.ciiva.com/7972/bc846alt1-d-7972186.pdf?src-supplier=Element14; ComponentLink7URL: https://datasheet.ciiva.com/7972/bc846alt1-d-7972187.pdf?src-supplier=Element14; ComponentLink7Description: https://datasheet.ciiva.com/7972/bc846alt1-d-7972187.pdf?src-supplier=Element14; ComponentLink8URL: https://datasheet.ciiva.com/11197/bc846alt1-d-11197532.pdf?src-supplier=Avnet; ComponentLink8Description: https://datasheet.ciiva.com/11197/bc846alt1-d-11197532.pdf?src-supplier=Avnet; Supplier Part Number 1: BC846ALT1GOSCT-ND
X6-X9 = CON_2p_B2B-XH-A(LF)(SN): Conn Shrouded Header (4 Sides) HDR 2 POS 2.5mm Solder ST Thru-Hole Box; Manufacturer: JST; Number of Positions: 2; Connector Type: Male Pin; Current Rating: 3A; Contact Resistance: 20mR; Voltage Rating: 250V; Insulation Resistance: 1GR; Wire/Cable Gauge: 22AWG; Supplier 1: Farnell; Manufacturer Part Number: B2B-XH-A(LF)(SN); RoHS: Yes; Category: FFC / FPC; Stock 1: 138104; Pricing 1: 100=0,06890, 1000=0,06030, 2500=0,05600, 5000=0,05160, 10000=0,05030, 20000=0,04930 (EUR); Mount: Through Hole; Contact Plating: Tin,Copper,Lead; Color: Natural; Contact Material: Brass; Housing Color: White; Housing Material: Polyamide; Min Operating Temperature: -25°C; Max Operating Temperature: 85°C; Number of Rows: 1; Packaging: Bulk; Termination: Solder; Fastening Type: Detent; Max Current Rating: 3A; Voltage Rating (AC): 250V; Max Voltage Rating (AC): 250V; Number of Contacts: 2; Max Voltage Rating (DC): 250V; Orientation: Straight; Length: 7.4mm; Pitch: 2.5mm; Lead Pitch: 2.5mm; Depth: 5.75mm; REACH SVHC: No SVHC; Lead Free: Lead Free; ComponentLink1URL: https://datasheet.ciiva.com/26894/getdatasheetpartid-640357-26894434.pdf?src-supplier=Verical; ComponentLink1Description: https://datasheet.ciiva.com/26894/getdatasheetpartid-640357-26894434.pdf?src-supplier=Verical; ComponentLink2URL: https://datasheet.ciiva.com/11746/0900766b8082653e-11746979.pdf?src-supplier=RSComponents; ComponentLink2Description: https://datasheet.ciiva.com/11746/0900766b8082653e-11746979.pdf?src-supplier=RSComponents; ComponentLink3URL: https://datasheet.ciiva.com/26894/getdatasheetpartid-385291-26894760.pdf?src-supplier=Verical; ComponentLink3Description: https://datasheet.ciiva.com/26894/getdatasheetpartid-385291-26894760.pdf?src-supplier=Verical; ComponentLink4URL: https://datasheet.ciiva.com/8052/5448-8052024.pdf?src-supplier=Element14; ComponentLink4Description: https://datasheet.ciiva.com/8052/5448-8052024.pdf?src-supplier=Element14; ComponentLink5URL: https://datasheet.ciiva.com/20207/523653-20207167.pdf?src-supplier=Rapid+Electronics; ComponentLink5Description: https://datasheet.ciiva.com/20207/523653-20207167.pdf?src-supplier=Rapid+Electronics; Supplier Part Number 1: 1516276